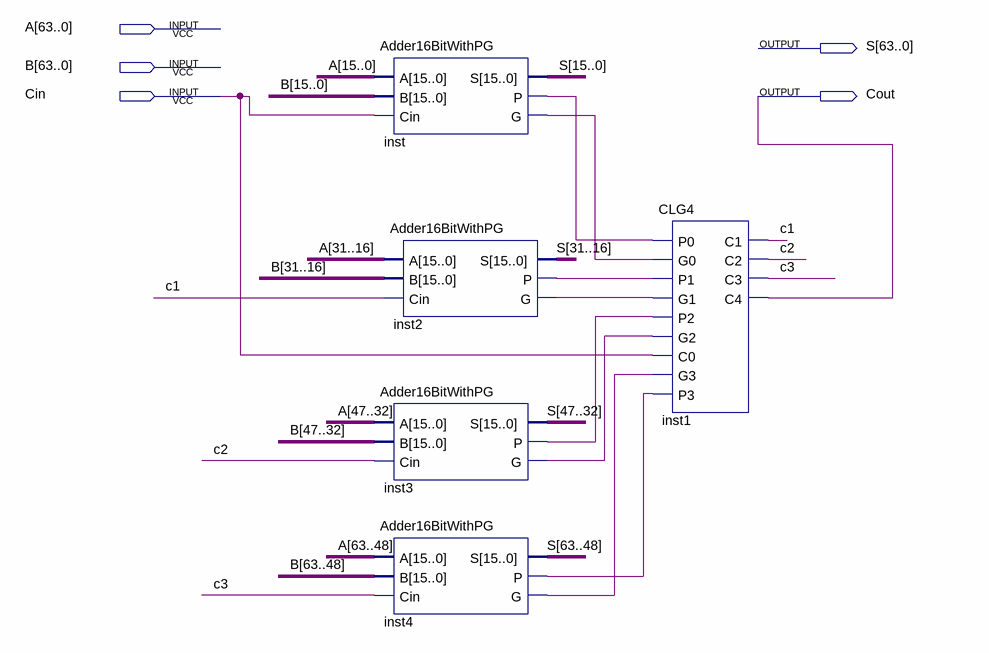
[diagram p0: schematic sheet]
// Quartus schematic Adder64Bit.bdf as structural Verilog: 5 symbols, 5 pins
module Adder64Bit (
  input  [63:0] A,
  input  [63:0] B,
  input  Cin,
  output [63:0] S,
  output Cout
);

  wire c1, c2, c3, inst2_g, inst2_p, inst3_g, inst3_p, inst4_g, inst4_p, inst_g, inst_p;

  Adder16BitWithPG inst (.A(A[15:0]), .B(B[15:0]), .Cin(Cin), .S(S[15:0]), .P(inst_p), .G(inst_g));
  Adder16BitWithPG inst2 (.A(A[31:16]), .B(B[31:16]), .Cin(c1), .S(S[31:16]), .P(inst2_p), .G(inst2_g));
  Adder16BitWithPG inst3 (.A(A[47:32]), .B(B[47:32]), .Cin(c2), .S(S[47:32]), .P(inst3_p), .G(inst3_g));
  Adder16BitWithPG inst4 (.A(A[63:48]), .B(B[63:48]), .Cin(c3), .S(S[63:48]), .P(inst4_p), .G(inst4_g));
  CLG4 inst1 (
    .P0(inst_p), .G0(inst_g), .P1(inst2_p), .G1(inst2_g), .P2(inst3_p), .G2(inst3_g), .C0(Cin), .G3(inst4_g),
    .P3(inst4_p), .C1(c1), .C2(c2), .C3(c3), .C4(Cout));
endmodule
